# Altium schematic sheet schema4.SchDoc
size A3; DrawnBy: CdB; Engineer: CdB; Organization: Ultimaker B.V.; DocumentNumber: 4; Revision: 1548-I; SheetNumber: 4; SheetTotal: 6; PageSetup: Record=PageOptions|CenterHorizontal=True|CenterVertical=True|PrintScale=1.01|XCorrection=1.00|YCorrection=1.00|PrintKind=1|BorderSize=5000000|LeftOffset=0|BottomOffset=0|Orientation=2|PaperLength=1000|PaperWidth=1000|Scale=100|PaperSource=7|PrintQuality=1200|MediaType=1|DitherType=10|PaperKind=A3 (297 x 420mm)|PrintScaleMode=1
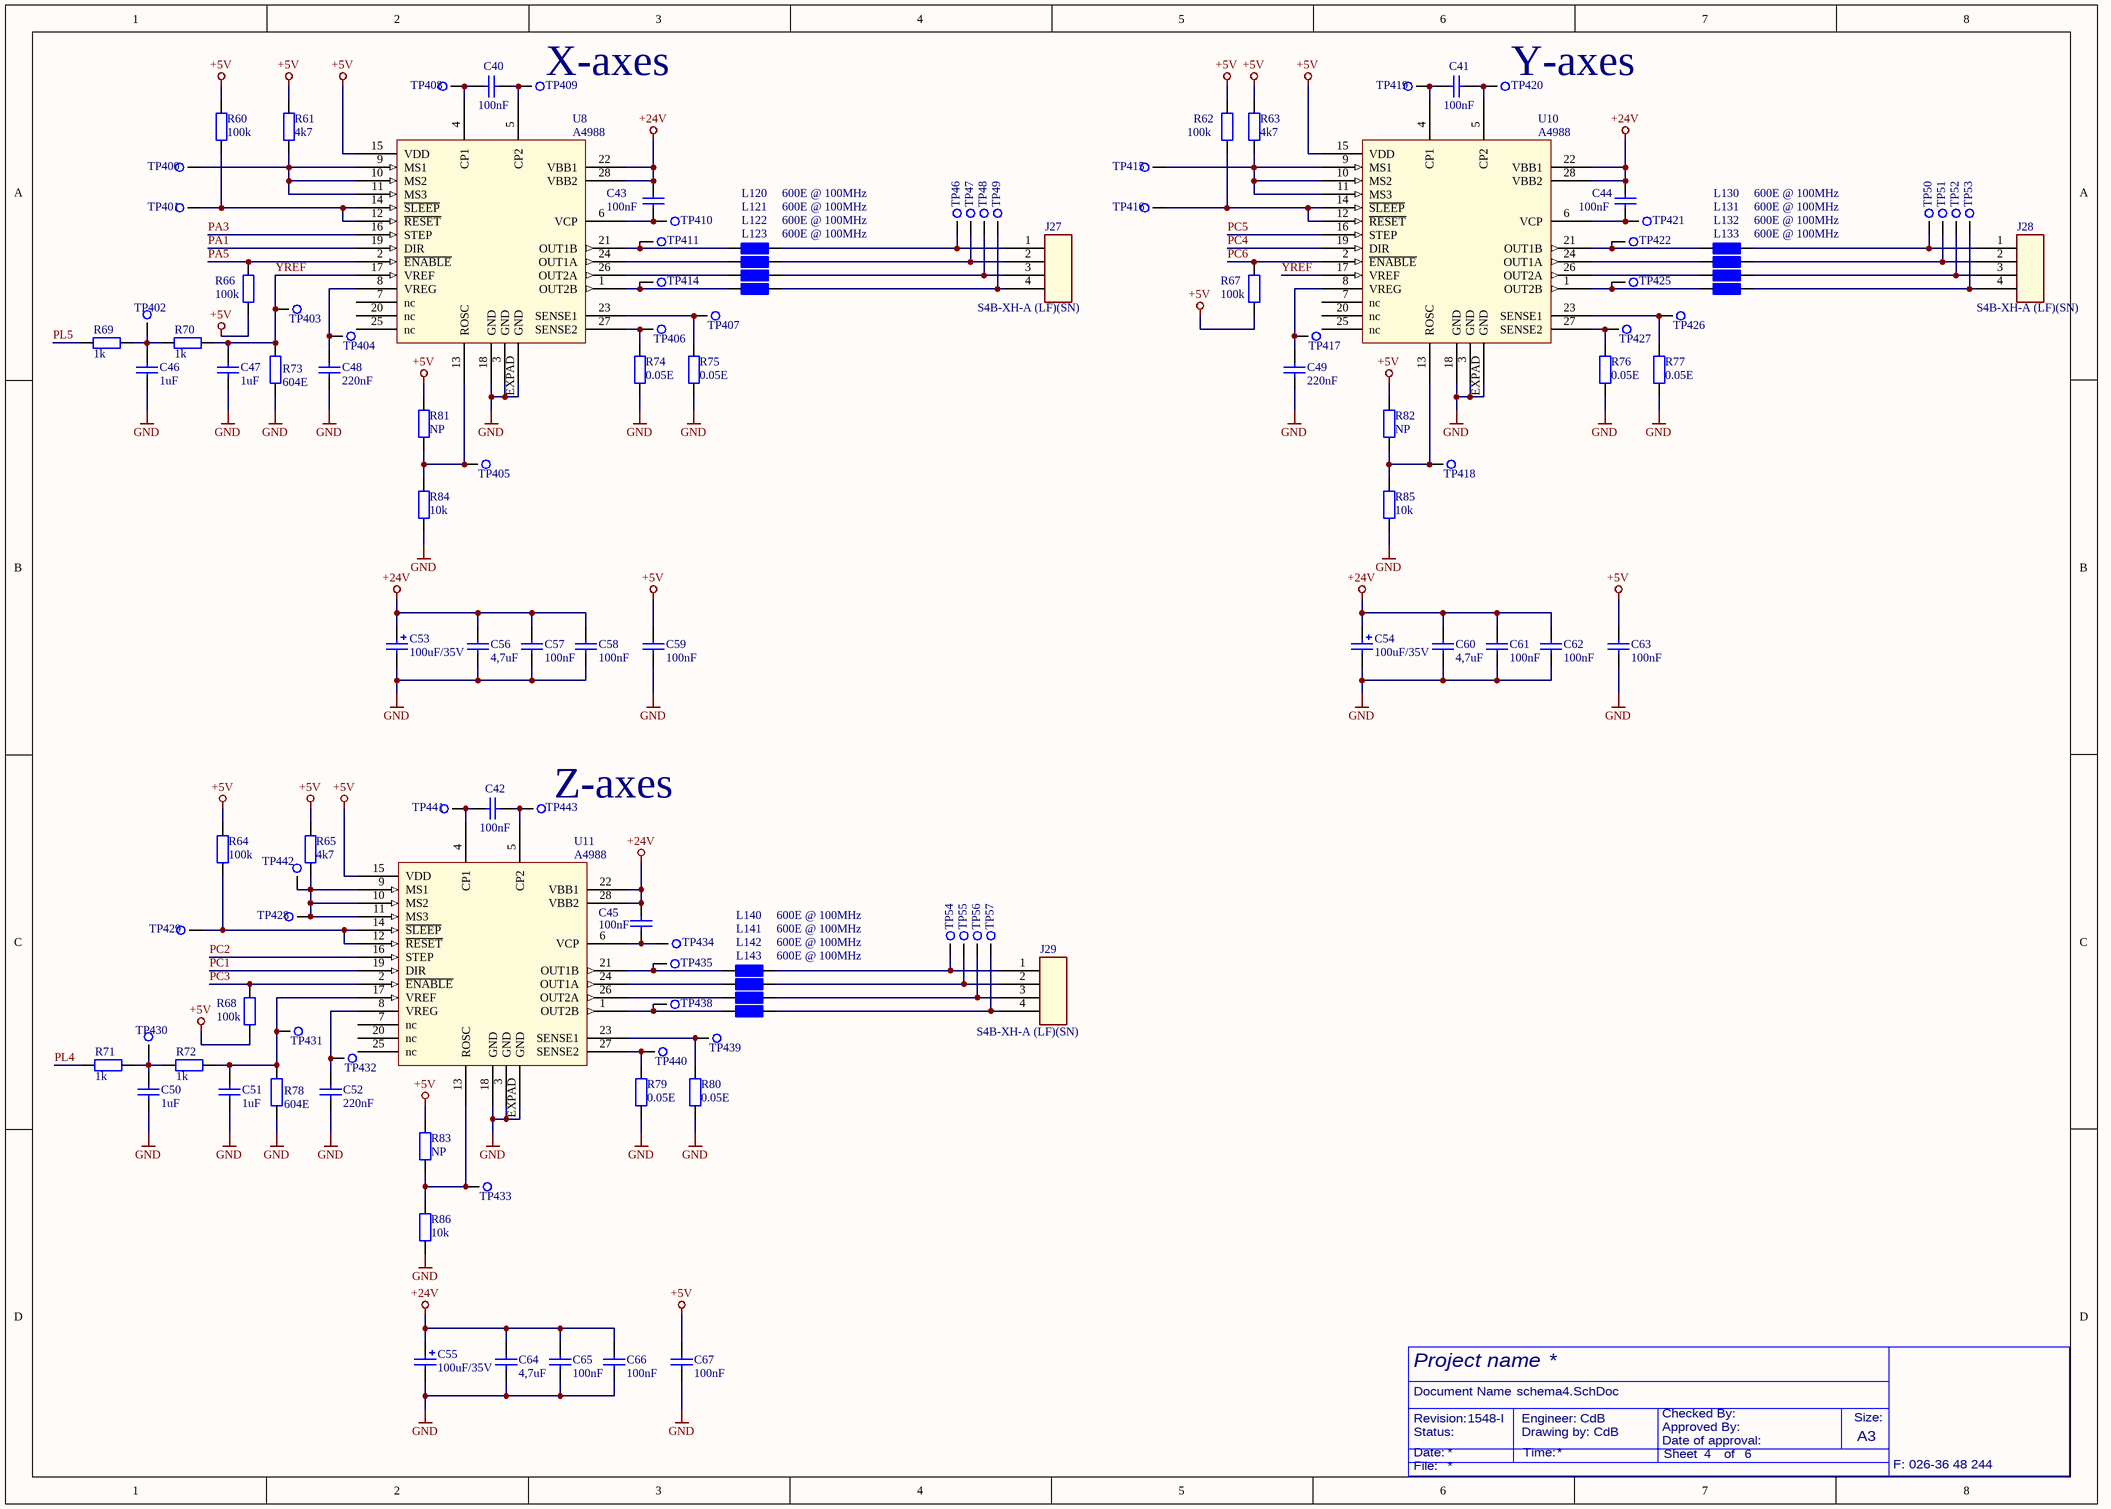
[diagram p0: schema4.SchDoc]

## Parts
C40  100nF  [C0603]
C41  100nF  [C0603]
C42  100nF  [C0603]
C43  100nF  [C0603]
C44  100nF  [C0603]
C45  100nF  [C0603]
C46  1uF  [C0603]
C47  1uF  [C0603]
C48  220nF  [C0603]
C49  220nF  [C0603]
C50  1uF  [C0603]
C51  1uF  [C0603]
C52  220nF  [C0603]
C53  100uF/35V  [ELCO Case D]
C54  100uF/35V  [ELCO Case D]
C55  100uF/35V  [ELCO Case D]
C56  4,7uF  [C1206]
C57  100nF  [C0603]
C58  100nF  [C0603]
C59  100nF  [C0603]
C60  4,7uF  [C1206]
C61  100nF  [C0603]
C62  100nF  [C0603]
C63  100nF  [C0603]
C64  4,7uF  [C1206]
C65  100nF  [C0603]
C66  100nF  [C0603]
C67  100nF  [C0603]
J27  S4B-XH-A (LF)(SN)  [S4B-XH-A (LF)(SN)]
J28  S4B-XH-A (LF)(SN)  [S4B-XH-A (LF)(SN)]
J29  S4B-XH-A (LF)(SN)  [S4B-XH-A (LF)(SN)]
L120  600E @ 100MHz  [R1206]
L121  600E @ 100MHz  [R1206]
L122  600E @ 100MHz  [R1206]
L123  600E @ 100MHz  [R1206]
L130  600E @ 100MHz  [R1206]
L131  600E @ 100MHz  [R1206]
L132  600E @ 100MHz  [R1206]
L133  600E @ 100MHz  [R1206]
L140  600E @ 100MHz  [R1206]
L141  600E @ 100MHz  [R1206]
L142  600E @ 100MHz  [R1206]
L143  600E @ 100MHz  [R1206]
R60  100k  [R0603]
R61  4k7  [R0603]
R62  100k  [R0603]
R63  4k7  [R0603]
R64  100k  [R0603]
R65  4k7  [R0603]
R66  100k  [R0603]
R67  100k  [R0603]
R68  100k  [R0603]
R69  1k  [R0603]
R70  1k  [R0603]
R71  1k  [R0603]
R72  1k  [R0603]
R73  604E  [R0603]
R74  0.05E  [R0805]
R75  0.05E  [R0805]
R76  0.05E  [R0805]
R77  0.05E  [R0805]
R78  604E  [R0603]
R79  0.05E  [R0805]
R80  0.05E  [R0805]
R81  NP  [R0603]
R82  NP  [R0603]
R83  NP  [R0603]
R84  10k  [R0603]
R85  10k  [R0603]
R86  10k  [R0603]
TP46  Testpoint  [Testpoint]  (value not drawn)
TP47  Testpoint  [Testpoint]  (value not drawn)
TP48  Testpoint  [Testpoint]  (value not drawn)
TP49  Testpoint  [Testpoint]  (value not drawn)
TP50  Testpoint  [Testpoint]  (value not drawn)
TP51  Testpoint  [Testpoint]  (value not drawn)
TP52  Testpoint  [Testpoint]  (value not drawn)
TP53  Testpoint  [Testpoint]  (value not drawn)
TP54  Testpoint  [Testpoint]  (value not drawn)
TP55  Testpoint  [Testpoint]  (value not drawn)
TP56  Testpoint  [Testpoint]  (value not drawn)
TP57  Testpoint  [Testpoint]  (value not drawn)
TP400  Testpoint  [TESTPOINT]  (value not drawn)
TP401  Testpoint  [TESTPOINT]  (value not drawn)
TP402  Testpoint 1mm  [Testpoint 1mm]  (value not drawn)
TP403  Testpoint 1mm  [Testpoint 1mm]  (value not drawn)
TP404  Testpoint 1mm  [Testpoint 1mm]  (value not drawn)
TP405  Testpoint 1mm  [Testpoint 1mm]  (value not drawn)
TP406  Testpoint 1mm  [Testpoint 1mm]  (value not drawn)
TP407  Testpoint 1mm  [Testpoint 1mm]  (value not drawn)
TP408  Testpoint 1mm  [Testpoint 1mm]  (value not drawn)
TP409  Testpoint 1mm  [Testpoint 1mm]  (value not drawn)
TP410  Testpoint 1mm  [Testpoint 1mm]  (value not drawn)
TP411  Testpoint 1mm  [Testpoint 1mm]  (value not drawn)
TP414  Testpoint 1mm  [Testpoint 1mm]  (value not drawn)
TP415  Testpoint  [TESTPOINT]  (value not drawn)
TP416  Testpoint  [TESTPOINT]  (value not drawn)
TP417  Testpoint 1mm  [Testpoint 1mm]  (value not drawn)
TP418  Testpoint 1mm  [Testpoint 1mm]  (value not drawn)
TP419  Testpoint 1mm  [Testpoint 1mm]  (value not drawn)
TP420  Testpoint 1mm  [Testpoint 1mm]  (value not drawn)
TP421  Testpoint 1mm  [Testpoint 1mm]  (value not drawn)
TP422  Testpoint 1mm  [Testpoint 1mm]  (value not drawn)
TP425  Testpoint 1mm  [Testpoint 1mm]  (value not drawn)
TP426  Testpoint 1mm  [Testpoint 1mm]  (value not drawn)
TP427  Testpoint 1mm  [Testpoint 1mm]  (value not drawn)
TP428  Testpoint  [TESTPOINT]  (value not drawn)
TP429  Testpoint  [TESTPOINT]  (value not drawn)
TP430  Testpoint 1mm  [Testpoint 1mm]  (value not drawn)
TP431  Testpoint 1mm  [Testpoint 1mm]  (value not drawn)
TP432  Testpoint 1mm  [Testpoint 1mm]  (value not drawn)
TP433  Testpoint 1mm  [Testpoint 1mm]  (value not drawn)
TP434  Testpoint 1mm  [Testpoint 1mm]  (value not drawn)
TP435  Testpoint 1mm  [Testpoint 1mm]  (value not drawn)
TP438  Testpoint 1mm  [Testpoint 1mm]  (value not drawn)
TP439  Testpoint 1mm  [Testpoint 1mm]  (value not drawn)
TP440  Testpoint 1mm  [Testpoint 1mm]  (value not drawn)
TP441  Testpoint 1mm  [Testpoint 1mm]  (value not drawn)
TP442  Testpoint  [TESTPOINT]  (value not drawn)
TP443  Testpoint 1mm  [Testpoint 1mm]  (value not drawn)
U8  A4988  [QFN50P500X500X100-28-EX]
U10  A4988  [QFN50P500X500X100-28-EX]
U11  A4988  [QFN50P500X500X100-28-EX]

## Nets
+5V: C59.2 C63.2 C67.2 R60.2 R61.2 R62.2 R63.2 R64.2 R65.2 R66.2 R67.2 R68.2 R81.2 R82.2 R83.2 U8.15(VDD) U10.15(VDD) U11.15(VDD)
+24V: C43.2 C44.2 C45.2 C53.1 C54.1 C55.1 C56.2 C57.2 C58.2 C60.2 C61.2 C62.2 C64.2 C65.2 C66.2 U8.22(VBB1) U8.28(VBB2) U10.22(VBB1) U10.28(VBB2) U11.22(VBB1) U11.28(VBB2)
GND: C46.1 C47.1 C48.1 C49.1 C50.1 C51.1 C52.1 C53.2 C54.2 C55.2 C56.1 C57.1 C58.1 C59.1 C60.1 C61.1 C62.1 C63.1 C64.1 C65.1 C66.1 C67.1 R73.1 R74.1 R75.1 R76.1 R77.1 R78.1 R79.1 R80.1 R84.1 R85.1 R86.1 U8.3(GND) U8.18(GND) U8.EXPAD(GND) U10.3(GND) U10.18(GND) U10.EXPAD(GND) U11.3(GND) U11.18(GND) U11.EXPAD(GND)
PA1: U8.19(DIR)
PA3: U8.16(STEP)
PA5: R66.1 U8.2(~{ENABLE})
PC1: U11.19(DIR)
PC2: U11.16(STEP)
PC3: R68.1 U11.2(~{ENABLE})
PC4: U10.19(DIR)
PC5: U10.16(STEP)
PC6: R67.1 U10.2(~{ENABLE})
PL4: R71.1
PL5: R69.1
YREF: C47.2 R70.2 R73.2 TP403.1 U8.17(VREF) U10.17(VREF)
NetC40_1: C40.1 TP408.1 U8.4(CP1)
NetC40_2: C40.2 TP409.1 U8.5(CP2)
NetC41_1: C41.1 TP419.1 U10.4(CP1)
NetC41_2: C41.2 TP420.1 U10.5(CP2)
NetC42_1: C42.1 TP441.1 U11.4(CP1)
NetC42_2: C42.2 TP443.1 U11.5(CP2)
NetC43_1: C43.1 TP410.1 U8.6(VCP)
NetC44_1: C44.1 TP421.1 U10.6(VCP)
NetC45_1: C45.1 TP434.1 U11.6(VCP)
NetC46_2: C46.2 R69.2 R70.1 TP402.1
NetC48_2: C48.2 TP404.1 U8.8(VREG)
NetC49_2: C49.2 TP417.1 U10.8(VREG)
NetC50_2: C50.2 R71.2 R72.1 TP430.1
NetC51_2: C51.2 R72.2 R78.2 TP431.1 U11.17(VREF)
NetC52_2: C52.2 TP432.1 U11.8(VREG)
NetJ27_1: J27.1 L120.2 TP46.1
NetJ27_2: J27.2 L121.2 TP47.1
NetJ27_3: J27.3 L122.2 TP48.1
NetJ27_4: J27.4 L123.2 TP49.1
NetJ28_1: J28.1 L130.2 TP50.1
NetJ28_2: J28.2 L131.2 TP51.1
NetJ28_3: J28.3 L132.2 TP52.1
NetJ28_4: J28.4 L133.2 TP53.1
NetJ29_1: J29.1 L140.2 TP54.1
NetJ29_2: J29.2 L141.2 TP55.1
NetJ29_3: J29.3 L142.2 TP56.1
NetJ29_4: J29.4 L143.2 TP57.1
NetL120_1: L120.1 TP411.1 U8.21(OUT1B)
NetL121_1: L121.1 U8.24(OUT1A)
NetL122_1: L122.1 U8.26(OUT2A)
NetL123_1: L123.1 TP414.1 U8.1(OUT2B)
NetL130_1: L130.1 TP422.1 U10.21(OUT1B)
NetL131_1: L131.1 U10.24(OUT1A)
NetL132_1: L132.1 U10.26(OUT2A)
NetL133_1: L133.1 TP425.1 U10.1(OUT2B)
NetL140_1: L140.1 TP435.1 U11.21(OUT1B)
NetL141_1: L141.1 U11.24(OUT1A)
NetL142_1: L142.1 U11.26(OUT2A)
NetL143_1: L143.1 TP438.1 U11.1(OUT2B)
NetR60_1: R60.1 TP401.1 U8.12(~{RESET}) U8.14(~{SLEEP})
NetR61_1: R61.1 TP400.1 U8.9(MS1) U8.10(MS2) U8.11(MS3)
NetR62_1: R62.1 TP416.1 U10.12(~{RESET}) U10.14(~{SLEEP})
NetR63_1: R63.1 TP415.1 U10.9(MS1) U10.10(MS2) U10.11(MS3)
NetR64_1: R64.1 TP429.1 U11.12(~{RESET}) U11.14(~{SLEEP})
NetR65_1: R65.1 TP428.1 TP442.1 U11.9(MS1) U11.10(MS2) U11.11(MS3)
NetR74_2: R74.2 TP406.1 U8.27(SENSE2)
NetR75_2: R75.2 TP407.1 U8.23(SENSE1)
NetR76_2: R76.2 TP427.1 U10.27(SENSE2)
NetR77_2: R77.2 TP426.1 U10.23(SENSE1)
NetR79_2: R79.2 TP440.1 U11.27(SENSE2)
NetR80_2: R80.2 TP439.1 U11.23(SENSE1)
NetR81_1: R81.1 R84.2 TP405.1 U8.13(ROSC)
NetR82_1: R82.1 R85.2 TP418.1 U10.13(ROSC)
NetR83_1: R83.1 R86.2 TP433.1 U11.13(ROSC)

Not connected (* = marked no-connect by the designer): U8 7(nc) 20(nc) 25(nc); U10 7(nc) 20(nc) 25(nc); U11 7(nc) 20(nc) 25(nc)

## Notes on the sheet
- (near TP409) X-axes
- (near TP420) Y-axes
- (near TP443) Z-axes
- Project name
- Document Name
- Revision:
- Date:
- Status:
- Engineer:
- Drawing by:
- Time:
- Approved By:
- Checked By:
- Date of approval:
- Sheet
- of
- Size:
- A3
- File:
- F: 026-36 48 244

## Library data of the parts
C40-C45 C57-C59 C61-C63 C65-C67 = Library_CAP-0002: RO X7R 100nF 10% 50V 0603; Faber ItemCode: 45068500; ID: Library_CAP-0002; Value: 100nF
C46 C47 C50 C51 = Library_CAP-0006: RO X5R 1uF 10% 10V 0603; Faber ItemCode: 36310600; ID: Library_CAP-0006; Value: 1uF
C48 C49 C52 = Library_CAP-0001: RO X7R 220nF 10% 25V  0603; Faber ItemCode: 36126300; ID: Library_CAP-0001; Value: 220nF
C53-C55 = Library_CAP-0004: RO ELCO 100uF 20% 35V CASE-D EEEFP PAN; Faber ItemCode: 36865800; ID: Library_CAP-0004; Value: 100uF/35V
C56 C60 C64 = Library_CAP-0003: RO X7R 4,7uF 10% 50V 1206; Faber ItemCode: 35404600; ID: Library_CAP-0003; Value: 4,7uF
J27-J29 = Library_CON-0005: RO CONN PR 4p HKS S4B-XH-A (LF)(SN) JST; Mfg: JST (JAPAN SOLDERLESS TERMINALS); Faber ItemCode: 36926500; ID: Library_CON-0005; Mfg code: S4B-XH-A (LF)(SN); Value: S4B-XH-A (LF)(SN)
L120-L123 L130-L133 L140-L143 = Ferriet Bead 600E: FERRIET 742792118 1206 Wurth Elektronik; Mfg: Wurth Elektronics; Mfg code: 1800374; ID: -; Faber ItemCode: -; Info: Ferriet; Value: 600E @ 100MHz
R60 R62 R64 R66-R68 = Library_RES-0005: RO RES 100k0 1% 0,063W  0603; Faber ItemCode: 36257800; ID: Library_RES-0005; Info: Resistor; Value: 100k
R61 R63 R65 = Library_RES-0002: RO RES 4k70 1% 0,063W  0603; Faber ItemCode: 36257400; ID: Library_RES-0002; Info: Resistor; Value: 4k7
R69-R72 = Library_RES-0004: RO RES 1k0 1% 0,1W  0603; Faber ItemCode: 34637900; ID: Library_RES-0004; Info: Resistor; Value: 1k
R73 R78 = Library_RES-0018: RO RES 604E 1% 0,063W 0603; Mfg: VISHAY DRALORIC; Mfg code: CRCW0603604RFKEA; Faber ItemCode: 36932600; ID: Library_RES-0018; Info: Resistor; Value: 604E
R74-R77 R79 R80 = Library_RES-0013: RO RES 0E05 1% 0,125W 0805; Mfg: BOURNS; Mfg code: CRL0805-FW-R050ELF; Faber ItemCode: 36925700; ID: Library_RES-0013; Info: Resistor; Value: 0.05E
R81-R83 = Library_RES-0001
R84-R86 = Library_RES-0001: RO RES 10k0 1% 0,063W  0603; Faber ItemCode: 36084500; ID: Library_RES-0001; Info: Resistor; Value: 10k
TP46-TP57 = Library_MISC-0001: Info: Testpoint, 2mm, round; ID: Library_MISC-0001; Faber ItemCode: -; Mfg: -; Mfg code: -; Value: Testpoint
TP400-TP411 TP414-TP422 TP425-TP435 TP438-TP443 = Testpoint 1mm: ID: Library_MISC-0001; Faber ItemCode: -; Mfg: -; Mfg code: -
  TP400 TP401 TP415 TP416 TP428 TP429 TP442: Info: Testpoint; Value: Testpoint
  TP402-TP411 TP414 TP417-TP422 TP425-TP427 TP430-TP435 TP438-TP441 TP443: Info: Testpoint 1mm; Value: Testpoint 1mm
U8 U10 U11 = Library_ICS-0002: RO IC A4988 QFN-28 ALLEGRO; Mfg code: A4988SETTR-T; Info: DMOS Microstepping Driver with Translator and Overcurrent Protection; Faber ItemCode: 36921600; ID: Library_ICS-0002; Mfg: Allegro; Value: A4988